# EAGLE design frontpanel (EAGLE 5.11)
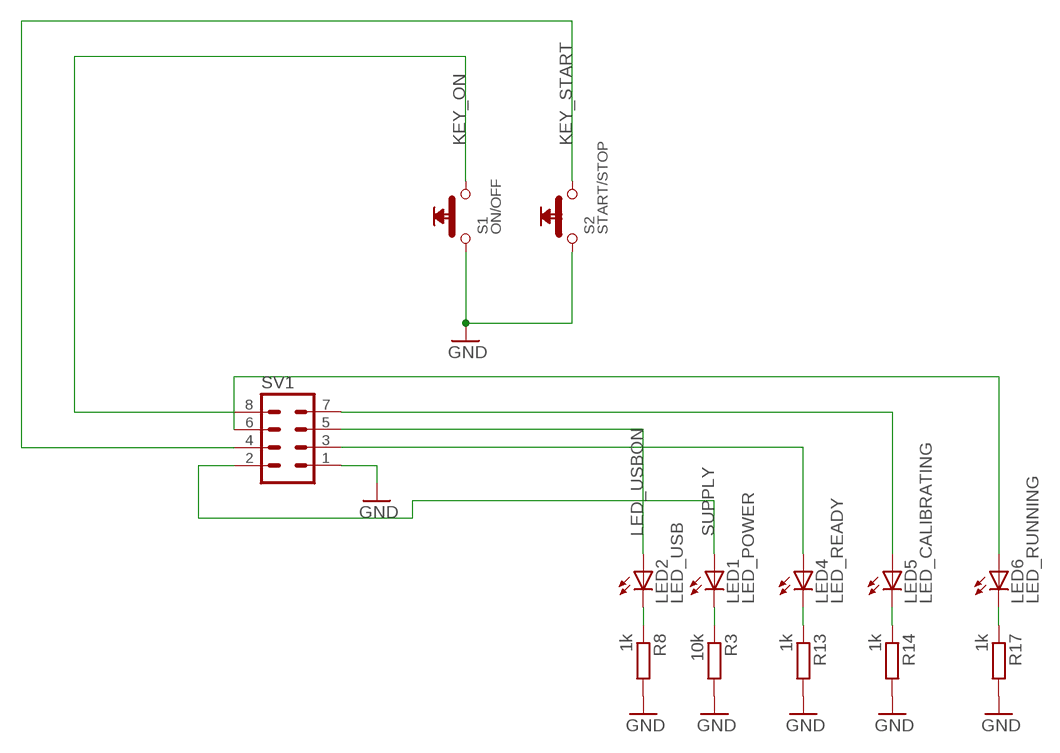
[diagram p0: schematic, sheet 1]

## Parts
LED1  LED_POWER  TLLR4400  [LED3MM]
LED2  LED_USB  TLLR4400  [LED3MM]
LED4  LED_READY  TLLR4400  [LED3MM]
LED5  LED_CALIBRATING  TLLR4400  [LED3MM]
LED6  LED_RUNNING  TLLR4400  [LED3MM]
R3  10k  R-EU_M0805  [M0805]
R8  1k  R-EU_M0805  [M0805]
R13  1k  R-EU_M0805  [M0805]
R14  1k  R-EU_M0805  [M0805]
R17  1k  R-EU_M0805  [M0805]
S1  ON/OFF  SP1X1A  [SP1X1A]
S2  START/STOP  SP1X1A  [SP1X1A]
SV1  MA04-2  [MA04-2]

## Nets
GND: R3.2 R8.2 R13.2 R14.2 R17.2 S1.1(SI) S2.1(SI) SV1.1
KEY_ON: S1.2(SO) SV1.8
KEY_START: S2.2(SO) SV1.4
LED_CALIBRATING: LED5.A SV1.7
LED_READY: LED4.A SV1.3
LED_RUNNING: LED6.A SV1.6
LED_USBON: LED2.A SV1.5
N$2: LED2.K(C) R8.1
N$3: LED4.K(C) R13.1
N$4: LED1.K(C) R3.1
N$7: LED5.K(C) R14.1
N$8: LED6.K(C) R17.1
SUPPLY: LED1.A SV1.2

## Library data of the parts
LED1 LED2 LED4-LED6 = led:TLLR4400: Low Current (2mA) LED 3 mm Tinted Diffused Package color RED Source: Data sheet <http://www.farnell.com/datasheets/391100.pdf>; MF: VISHAY SEMICONDUCTOR; OC_FARNELL: 1612437
R3 R8 R13 R14 R17 = rcl:R-EU_: RESISTOR, European symbol
S1 S2 = divers:SP1X1: Pushbutton switch 1*1
SV1 = con-lstb:MA04-2: PIN HEADER; OC_FARNELL: unknown; OC_NEWARK: unknown

## Board
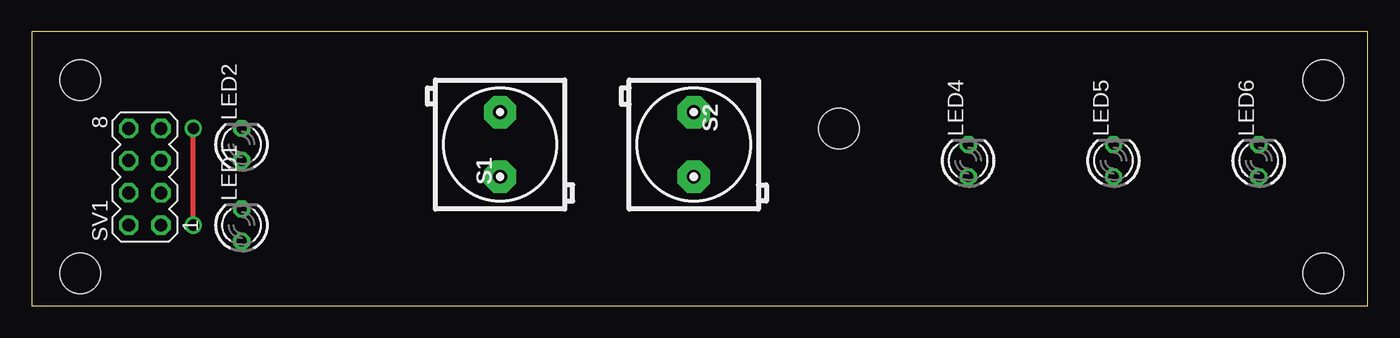
[diagram p1: board, top side]
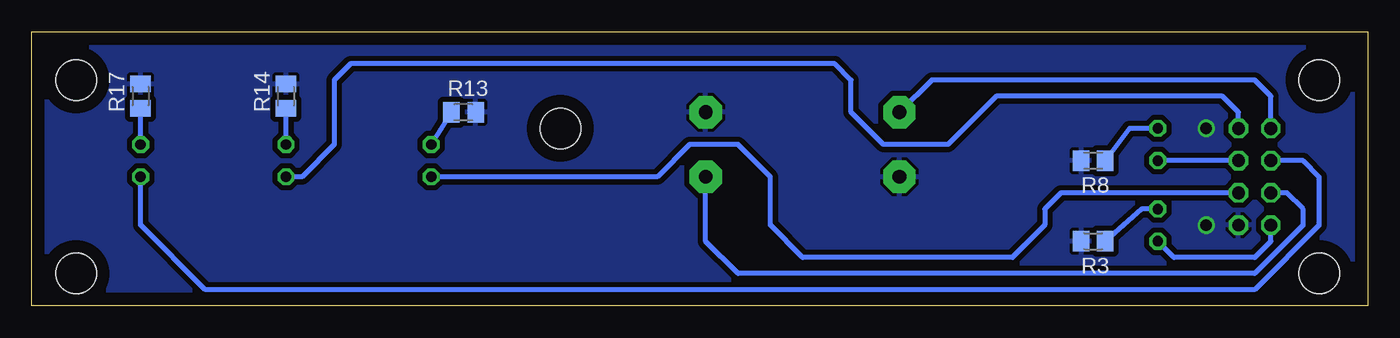
[diagram p2: board, bottom side, seen from below]

Size 105.08 x 21.58 mm. Coordinates in mm from the lower left corner, seen from the top.
Outline: 0,0 105.08,0 105.08,21.58 0,21.58 0,0
Copper layers (1*16): Top 0.035mm / dielectric 1.5mm / Bottom 0.035mm
Design rules "default": minimum track width 10mil, minimum drill 24mil, track to track 8mil, track to pad 8mil, pad to pad 8mil, via to via 8mil, smd to smd 8mil, copper to edge 40mil, drill to drill 8mil, minimum pad ring 10mil, minimum via ring 8mil, stop-mask expansion 4mil, vias tented up to drill 0mil, thermal gap 10mil
Holes 3.2 mm at 3.81,2.54 3.81,17.78 63.5,13.97 101.6,2.54 101.6,17.78

### Footprints (pad centres in the part's own frame; a part is rotated, then mirrored left to right if it is on the bottom)
LED3MM = drill 0.813 octagon: A -1.27,0; K 1.27,0
M0805 = smd 1.3 x 1.6: 1 -0.95,0; 2 0.95,0
SP1X1A = drill 1.092 pad 2.54 octagon: 1 -2.54,0; 2 2.54,0
MA04-2 = drill 1.016 octagon: 1 -3.81,-1.27; 2 -3.81,1.27; 3 -1.27,-1.27; 4 -1.27,1.27; 5 1.27,-1.27; 6 1.27,1.27; 7 3.81,-1.27; 8 3.81,1.27

### Placement (x,y rotation side)
LED1  16.51,6.35 90 top
LED2  16.51,12.7 90 top
LED4  73.66,11.43 90 top
LED5  85.09,11.43 90 top
LED6  96.52,11.43 90 top
R3  21.59,5.08 180 bottom
R8  21.59,11.43 180 bottom
R13  71.12,15.24 0 bottom
R14  85.09,16.51 90 bottom
R17  96.52,16.51 90 bottom
S1  36.83,12.7 90 top
S2  52.07,12.7 270 top
SV1  8.89,10.16 90 top

### Tracks (layer width: path | path; a pad name or v marks a point on that pad's centre or on a via)
GND  (via drill 0.9)
  Top 0.406: v12.7,6.35 v12.7,13.97
  pour Bottom (isolate 0.406): 0,21.59 0,0 105.41,0 105.41,21.59
KEY_ON
  Bottom 0.406: SV1.8 7.62,16.51 8.89,17.78 34.29,17.78 S1.2
KEY_START
  Bottom 0.406: S2.2 52.07,5.08 49.53,2.54 8.89,2.54 5.08,6.35 5.08,7.62 6.35,8.89 SV1.4
LED_CALIBRATING
  Bottom 0.406: LED5.A 83.82,10.16 81.28,12.7 81.28,17.78 80.01,19.05 41.91,19.05 40.64,17.78 40.64,15.24 38.1,12.7 33.02,12.7 29.21,16.51 11.43,16.51 10.16,15.24 SV1.7
LED_READY
  Bottom 0.406: LED4.A 55.88,10.16 53.34,12.7 49.53,12.7 46.99,10.16 46.99,6.35 44.45,3.81 27.94,3.81 25.4,6.35 25.4,7.62 24.13,8.89 SV1.3
LED_RUNNING
  Bottom 0.406: LED6.A 96.52,6.35 91.44,1.27 8.89,1.27 3.81,6.35 3.81,10.16 5.08,11.43 SV1.6
LED_USBON
  Bottom 0.406: SV1.5 LED2.A
N$2
  Bottom 0.406: LED2.K 18.73,13.97 R8.1
N$3
  Bottom 0.406: R13.1 LED4.K
N$4
  Bottom 0.406: LED1.K 17.78,7.62 R3.1
N$7
  Bottom 0.406: LED5.K R14.1
N$8
  Bottom 0.406: LED6.K R17.1
SUPPLY
  Bottom 0.406: SV1.2 7.62,5.08 8.89,3.81 15.24,3.81 LED1.A